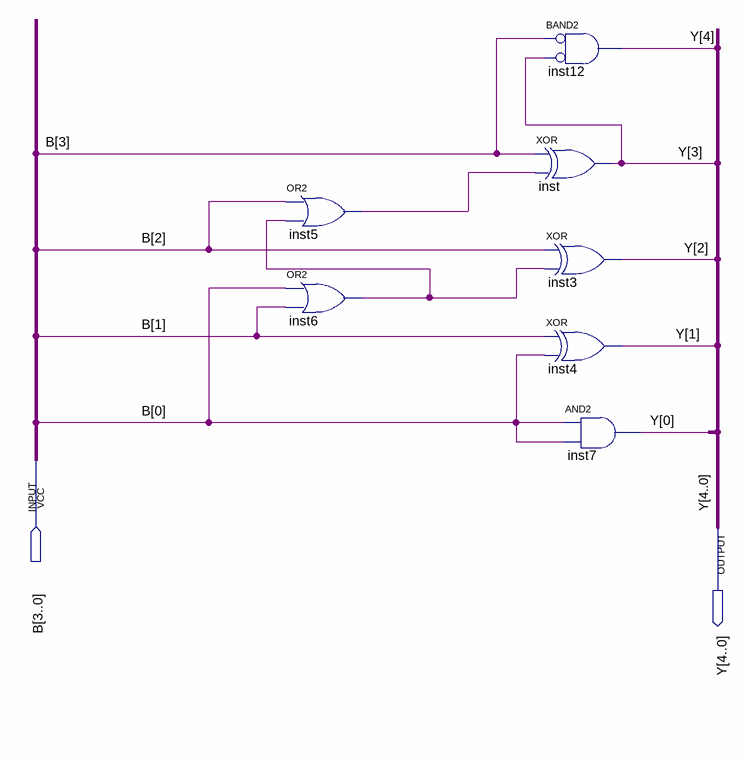
[diagram p0: schematic sheet]
// Quartus schematic Complemento02deB.bdf as structural Verilog: 7 symbols, 2 pins
module Complemento02deB (
  input  [3:0] B,
  output [4:0] Y
);

  wire inst5_out, inst6_out;

  or inst5 (inst5_out, B[2], inst6_out);
  or inst6 (inst6_out, B[0], B[1]);
  and inst12 (Y[4], ~B[3], ~Y[3]);  // BAND2
  xor inst (Y[3], B[3], inst5_out);
  xor inst3 (Y[2], B[2], inst6_out);
  xor inst4 (Y[1], B[1], B[0]);
  and inst7 (Y[0], B[0], B[0]);
endmodule
